# EasyEDA Pro project ProPrj_基于STM32的多功能串口分析仪_2025-03-12.epro, board PCB1
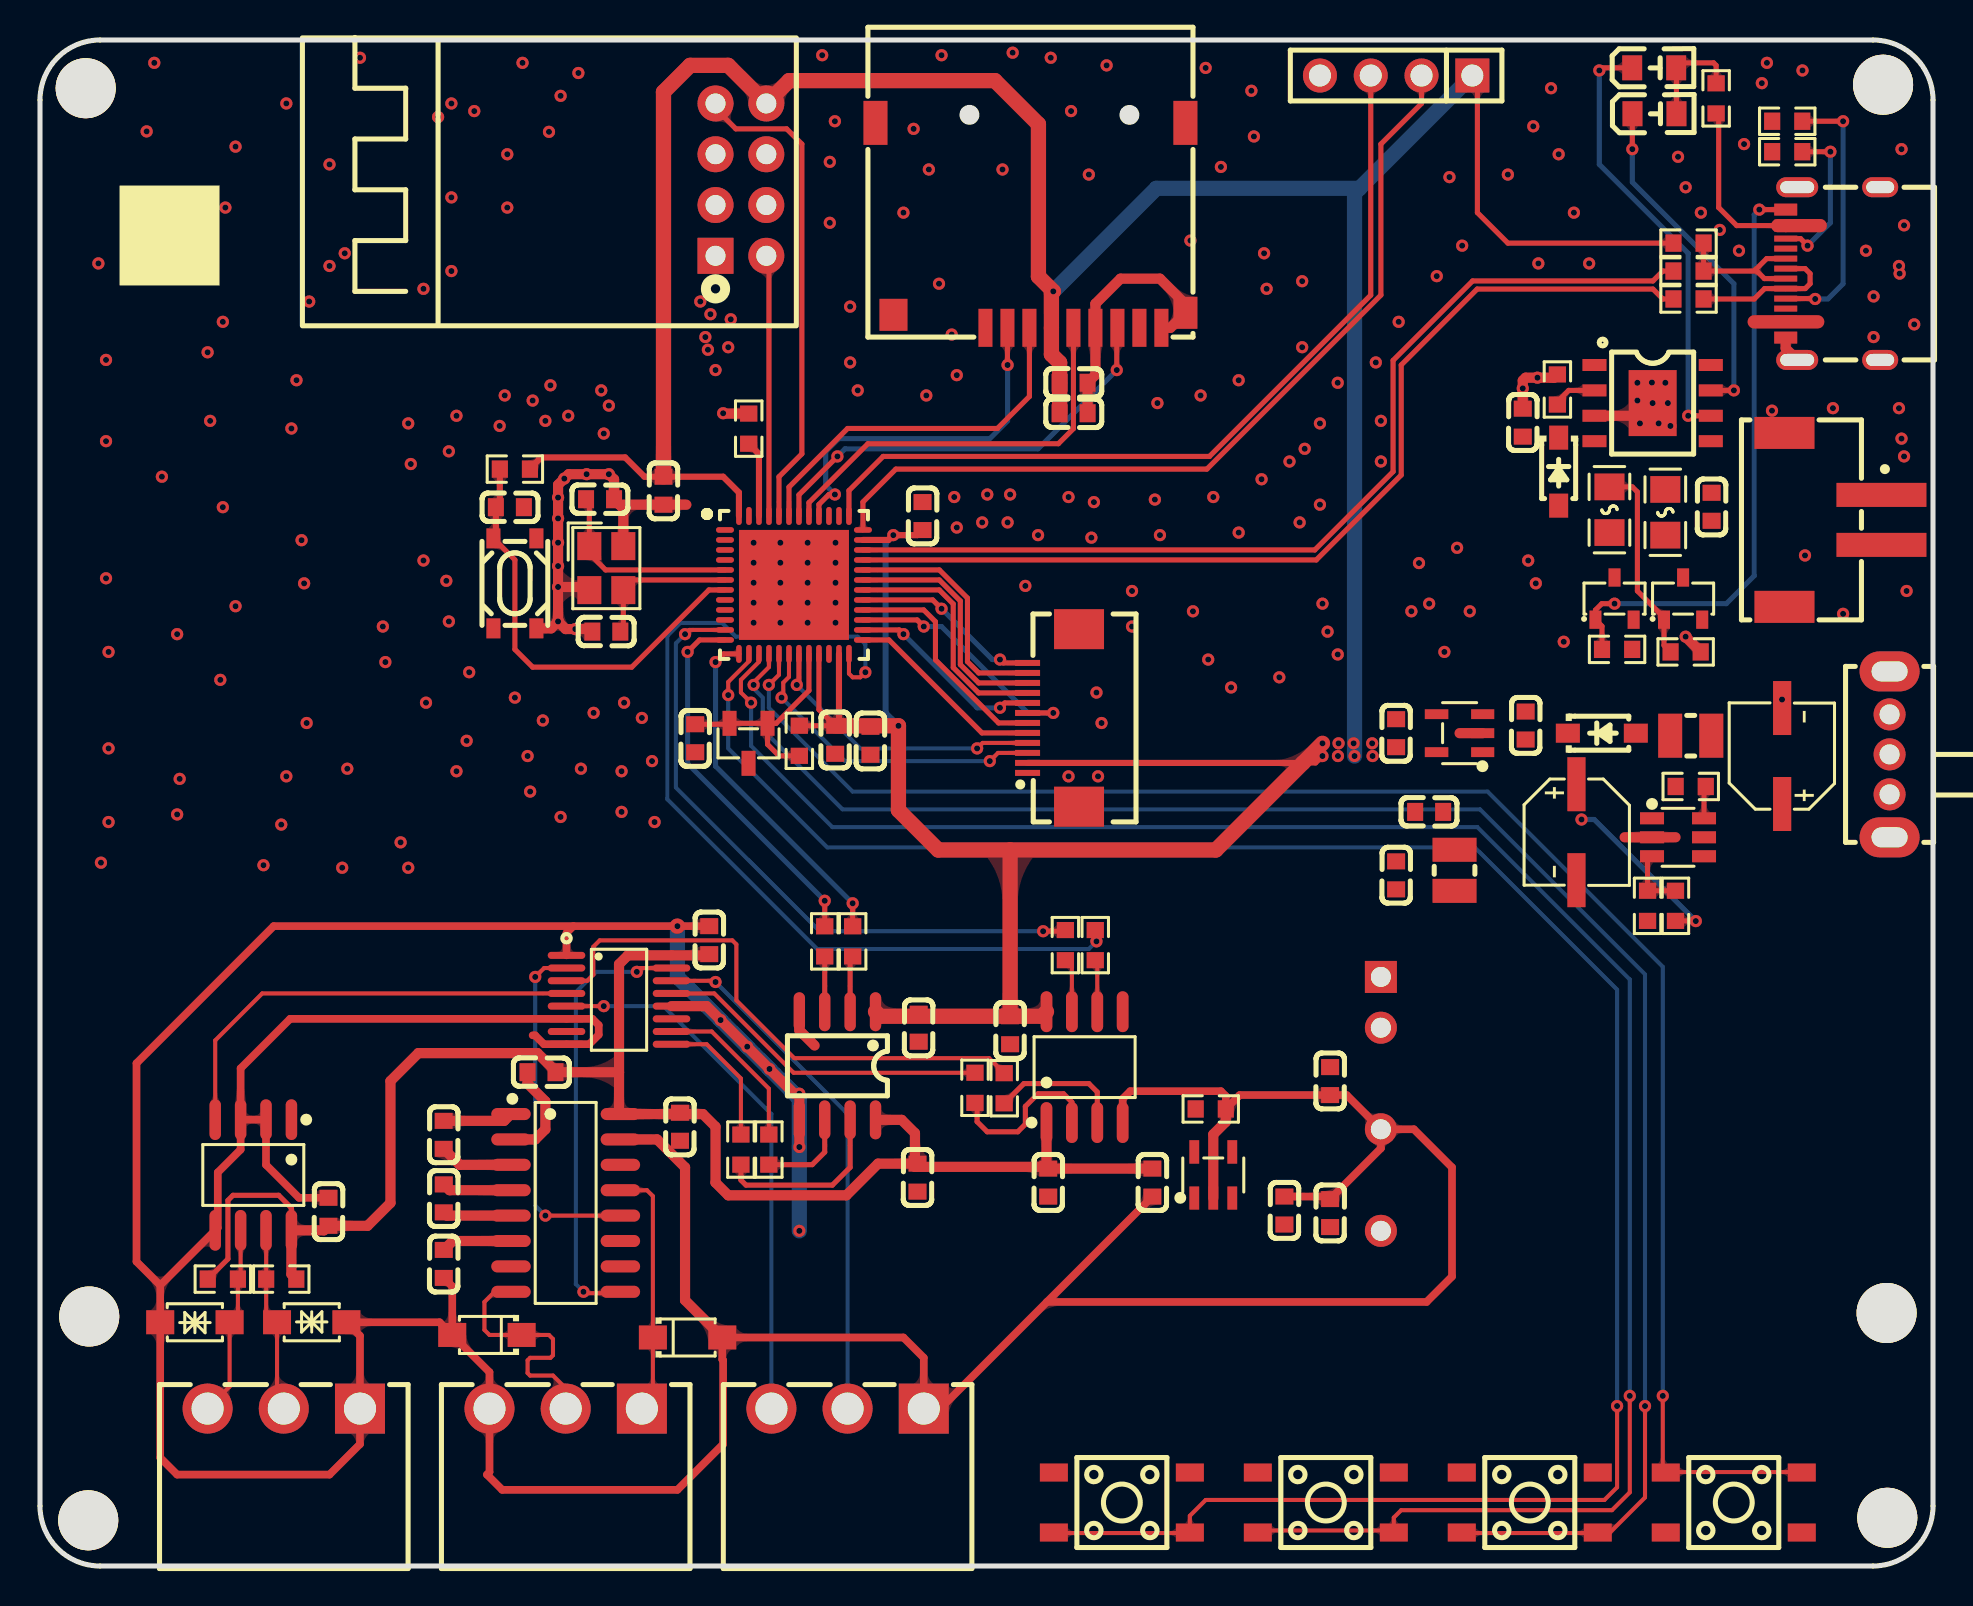
[diagram p17: board, top side]
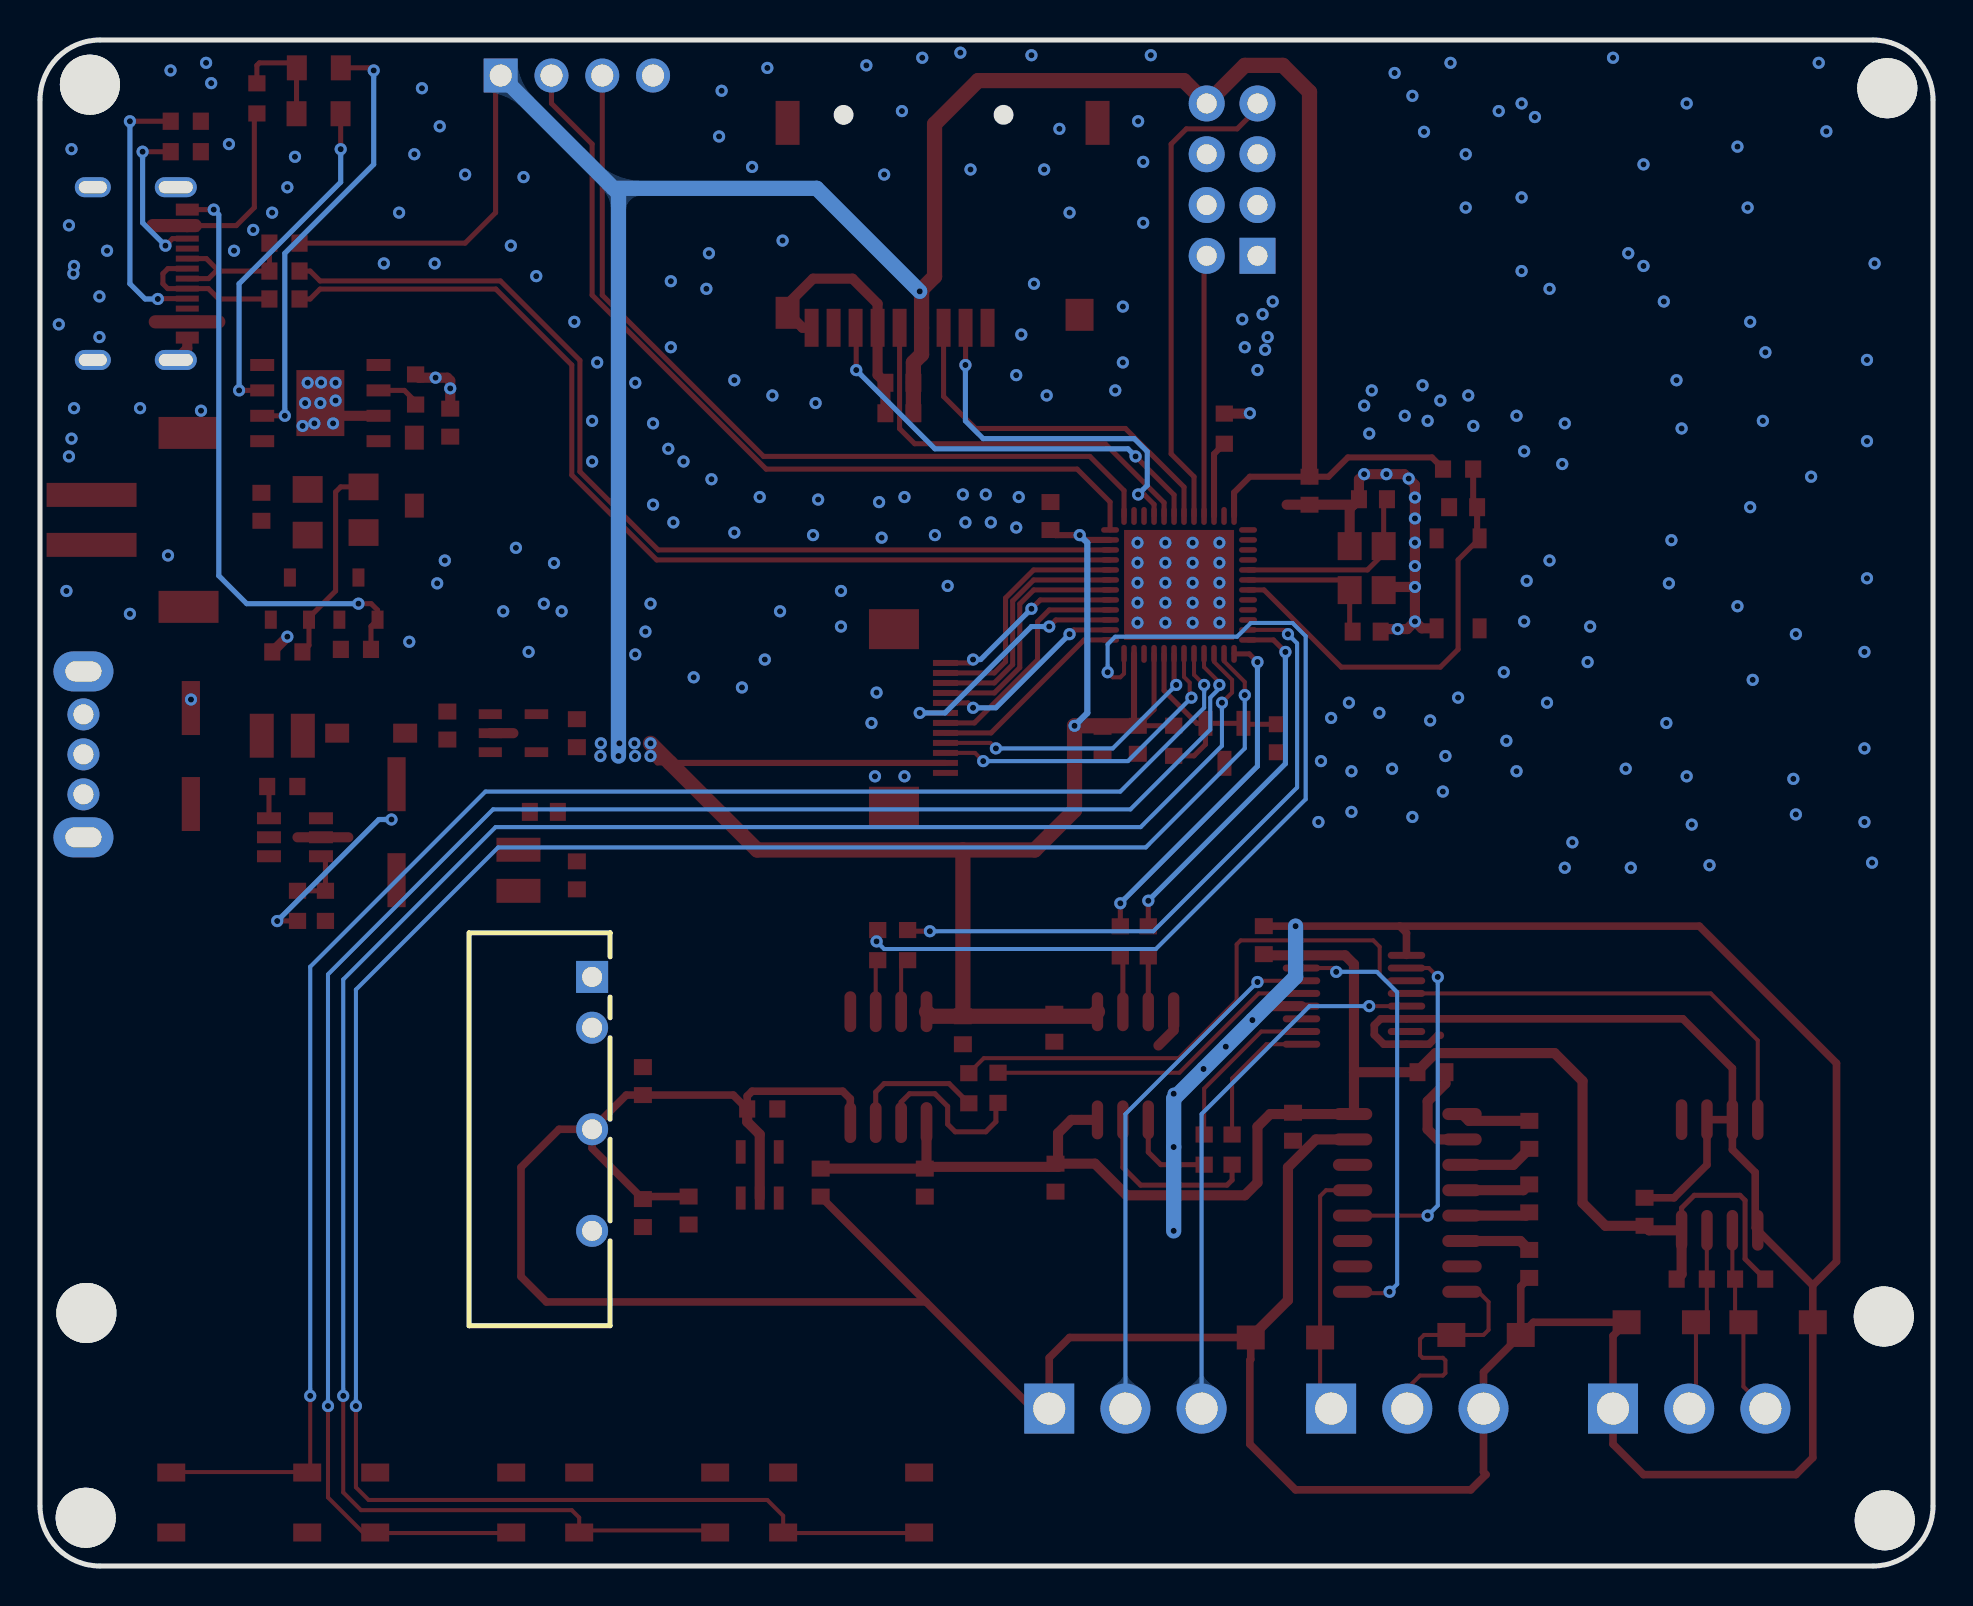
[diagram p18: board, bottom side, seen from below]

Outline 94.67 x 76.33 mm; copper layers: Top Layer, Bottom Layer. Coordinates in mm from the lower left corner of the outline.
Outline path: 0,73.33 0,3 arc(0.88,0.88) 3,0 91.67,0 arc(93.79,0.88) 94.67,3 94.67,73.33 arc(93.79,75.45) 91.67,76.33 3,76.33 arc(0.88,75.45) 0,73.33
Stack: Top Layer 0.035mm / Dielectric1 1.51mm FR4 er 4.5 / Bottom Layer 0.035mm

## Design rules (mm)
net USB_D+: DP1
net USB_D-: DP1
net PA11: DP2
net PA12: DP2
template: 自定义配置
spacing copperThickness1oz (default): track to track 0.102, other pairs 0.152 to 0.3
spacing copperThickness2oz: track to track 0.203, other pairs 0.152 to 0.3
track width copperThickness1oz (default): min 0.127, default 0.254, max 2.54
track width copperThickness2oz: min 0.203, default 0.254, max 2.54
differential pair differentialPair (default): width min 0.127, default 0.254, max 2.54; gap min 0.152, default 0.152
via viaSize (default): diameter min 0.5, default 0.61, max 10; hole min 0.3, default 0.305, max 6.3
net VBUS uses PWR
net $1N5372 uses PWR
net D_5V uses PWR
net 5V uses PWR
net DVDD uses PWR
net 3.3V uses PWR
net $1N8863 uses PWR
net BAT+ uses PWR
net $1N28343 uses PWR
net $1N9169 uses PWR
net VIN uses PWR
net $1N20026 uses PWR
net $1N19970 uses PWR

## Placement (name value [footprint] x y rotation side)
C1  1nF  [C0603]  64.52 24.25 270 top
C2  22uF  [C_Ele_SMD_5x5.4mm]  76.84 36.7 270 top
C3  4.7uF  [C0603]  69.47 37.72 0 top
C4  4.7uF  [C0603]  67.82 34.54 270 top
C5  10uF  [C0603]  62.23 17.78 270 top
C6  1uF  [C0603]  64.52 17.65 270 top
C7  10uF  [C0603]  74.15 57.19 270 top
C8  10uF  [C0603]  83.59 52.98 90 top
C9  1uF  [C0603]  55.63 19.18 270 top
C10  22uF  [C_Ele_SMD_5x5.4mm]  87.12 40.51 90 top
C11  100nF  [C0603]  48.51 26.8 90 top
C12  100nF  [C0603]  50.42 19.18 270 top
C13  100nF  [C0603]  25.08 24.7 0 top
C14  100nF  [C0603]  32 21.97 90 top
C15  100nF  [C0603]  31.18 53.78 90 top
C16  100nF  [C0603]  20.19 18.39 90 top
C17  100nF  [C0603]  20.19 21.57 270 top
C18  100nF  [C0603]  20.19 15.11 90 top
C19  100nF  [C0603]  41.53 41.28 90 top
C20  100nF  [C0603]  44.13 52.52 270 top
C21  100nF  [C0603]  23.5 52.96 180 top
C22  100nF  [C0603]  39.77 41.32 90 top
C23  100nF  [C0603]  43.94 26.92 90 top
C24  100nF  [C0603]  43.88 19.43 270 top
C25  100nF  [C0603]  14.42 17.72 270 top
C26  226  [C0603]  32.77 41.4 90 top
C27  12pF  [C0603]  28.32 46.74 0 top
C28  1uF  [C0603]  74.29 42.04 270 top
C29  1uF  [C0603]  67.82 41.66 90 top
C30  12pF  [C0603]  28.01 53.36 0 top
C31  100nF  [C0603]  33.47 31.3 270 top
C32  100nF  [C0603]  51.69 59.18 180 top
C33  10uF  [C0603]  51.69 57.66 180 top
CN1  DB2ERC-3.81-3P-GN  [CONN-TH_3P-P3.81_DB2ERC-3.81-3P]  26.29 7.87 0 top
CN2  DB2ERC-3.81-3P-GN  [CONN-TH_3P-P3.81_DB2ERC-3.81-3P]  12.19 7.87 0 top
CN3  DB2ERC-3.81-3P-GN  [CONN-TH_3P-P3.81_DB2ERC-3.81-3P]  40.39 7.87 0 top
D1  1N5819W  [SOD-123_L2.7-W1.6-LS3.7-RD-1]  78.1 41.66 0 top
D2  1N5819W  [SOD-123_L2.7-W1.6-LS3.7-RD-1]  75.95 54.74 270 top
D3  SMF15CA  [SOD-123FL_L2.7-W1.8-LS3.8-RD]  32.38 11.43 0 top
D4  SMF15CA  [SOD-123FL_L2.7-W1.8-LS3.8-RD]  22.35 11.56 180 top
D5  SMF6.5CA  [SOD-123FL_L2.7-W1.8-LS3.8-BI]  13.59 12.19 180 top
D6  SMF6.5CA  [SOD-123FL_L2.7-W1.8-LS3.8-BI]  7.75 12.19 0 top
F1  BSMD0805-010-33V  [F0805]  78.49 52.83 270 top
F2  BSMD0805-010-33V  [F0805]  81.28 52.71 270 top
FPC1  FPC-05F-12PH20  [FPC-SMD_12P-P0.50_FPC-05F-12PH20]  50.67 42.42 90 top
H1  -  [HDR-TH_4P-P2.54-V-F]  67.82 74.55 180 top
L2  6.8uH  [IND-SMD_L2.5-W2.0_FHD252010S-6R8MT]  70.74 34.8 90 top
L3  6.8uH  [IND-SMD_L2.5-W2.0_FHD252010S-6R8MT]  82.55 41.53 0 top
LED1  -  [LED_0805]  80.79 72.63 0 top
LED2  -  [LED_0805]  80.77 74.93 0 top
NOREF  -  [Pad_e108]  2.46 12.48 270 top
NOREF#2  -  [Pad_e48206]  92.38 2.41 0 top
NOREF#3  -  [Pad_e48205]  2.41 2.29 270 top
NOREF#4  -  [Pad_e107]  2.29 73.91 180 top
NOREF#5  -  [Pad_e110]  92.17 74.09 90 top
NOREF#6  -  [Pad_e109]  92.35 12.66 0 top
Q1  AO3401  [SOT-23-3_L2.9-W1.4-P1.90-LS2.6-BR]  78.74 48.39 270 top
Q2  AO3401  [SOT-23-3_L2.9-W1.4-P1.90-LS2.6-BR]  82.17 48.39 270 top
R1  1K  [R0603]  75.88 58.85 90 top
R2  1K  [R0603]  83.82 73.41 270 top
R3  20K  [R0603]  81.79 33.02 270 top
R4  93.1K  [R0603]  82.55 38.99 0 top
R5  510  [R0603]  58.55 22.86 180 top
R6  2.7K  [R0603]  80.39 33.02 90 top
R7  10K  [R0603]  78.87 45.85 180 top
R8  22R  [R0603]  51.28 31.06 270 top
R9  22R  [R0603]  46.76 23.92 90 top
R10  10K  [R0603]  23.75 54.86 0 top
R11  22R  [R0603]  52.77 31.06 270 top
R12  22R  [R0603]  48.22 23.9 90 top
R13  10K  [R0603]  82.3 45.72 0 top
R14  22R  [R0603]  40.64 31.24 270 top
R15  22R  [R0603]  35.05 20.83 90 top
R16  100R  [R0603]  37.97 41.28 90 top
R17  5.1K  [R0603]  87.38 72.26 180 top
R18  5.1K  [R0603]  87.38 70.74 180 top
R19  22R  [R0603]  39.24 31.24 270 top
R20  22R  [R0603]  36.45 20.83 90 top
R21  10K  [R0603]  12.06 14.35 0 top
R23  10K  [R0603]  35.44 56.89 90 top
R24  22R  [R0603]  82.44 64.77 180 top
R25  22R  [R0603]  82.44 63.37 180 top
R27  10K  [R0603]  9.14 14.35 0 top
R29  5.1K  [R0603]  82.44 66.17 0 top
SW1  SK12D07VG5  [SW-TH_SK12D07VG5]  92.49 40.6 90 top
SW2  TS3425BA  [SW-SMD_4P-L4.2-W3.2-P2.15-LS4.6-1]  23.75 49.15 270 top
SW3  TS4570TP  [SW-SMD_4P-L4.5-W4.5-P3.00-LS7.0]  84.7 3.18 0 top
SW4  TS4570TP  [SW-SMD_4P-L4.5-W4.5-P3.00-LS7.0]  74.5 3.18 180 top
SW5  TS4570TP  [SW-SMD_4P-L4.5-W4.5-P3.00-LS7.0]  64.3 3.18 180 top
SW6  TS4570TP  [SW-SMD_4P-L4.5-W4.5-P3.00-LS7.0]  54.1 3.18 180 top
U1  B0505S-3WR2  [PWRM-TH_B0505S-3WR2]  67.06 23.11 270 bottom
U2  TP4056  [ESOP-8_L4.9-W3.9-P1.27-LS6.0-BL-EP]  80.65 58.17 270 top
U3  RT9013-33GB  [SOT-23-5_L3.0-W1.7-P0.95-LS2.8-BL]  58.67 19.56 0 top
U4  MT3608L  [SOT-23-6_L2.9-W1.6-P0.95-LS2.8-BL_3]  81.91 36.45 270 top
U5  STM32G431CBU6  [UFQFPN-48_L7.0-W7.0-P0.50-BL-EP]  37.7 49.07 270 top
U6  ZX-XH2.54-2PLT  [CONN-SMD_2P-P2.50_HCTL_HC-XH-2ALT]  89.66 52.32 270 top
U7  MAX3232ESE+T  [SOIC-16_L9.9-W3.9-P1.27-LS6.0-BL]  26.29 18.16 270 top
U8  π120M31  [SOIC-8_L4.9-W3.9-P1.27-LS6.0-BL]  52.24 24.95 0 top
U9  π120U31  [soic-8_l5.0-w4.0-p1.27-ls6.0-bl]  39.88 25.02 180 top
U10  MAX3485ESA  [SOP-8_L5.0-W4.0-P1.27-LS6.0-BL]  10.67 19.56 180 top
U11  TL431  [SOT-23-3_L2.9-W1.3-P1.90-LS2.4-BR]  35.43 41.15 90 top
U12  RT9013-33GB  [SOT-23-5_L3.0-W1.7-P0.95-LS2.8-BL]  70.99 41.66 90 top
U13  -  [JLC-QRCODE-5x5]  6.48 66.55 0 top
U14  MR01A-01239  [TF-SMD_MR01A-01211]  49.53 67.06 180 top
U15  RS2252XSS16  [SSOP-16_L4.9-W3.9-P0.635-LS6.0-BL]  28.96 28.32 270 top
U16  Ai-Thinker ESP-01S ESP8266  [WIFIM-TH_8P-L24.7-W14.4-P2.54]  35.05 69.34 180 top
USB1  TYPE-C 16P(073)  [USB-C-SMD_TYPE-C16PIN_C668624]  89.66 64.64 90 top
X1  8MHz  [CRYSTAL-SMD_4P-L3.2-W2.5-BL]  28.32 49.91 270 top

## Footprints (pads in the part's own frame, mm; a bottom-side part is the same pattern mirrored in y, then rotated)
C0603
  rect 0.8x0.9 smd: 1(-0.7,0) 2(0.7,0)
C_Ele_SMD_5x5.4mm
  rect 2.7x0.91 smd: 1(-2.4,0) 2(2.4,0)
CONN-SMD_2P-P2.50_HCTL_HC-XH-2ALT
  rect 1.2x4.5 smd: 1(-1.25,2.425) 2(1.25,2.425)
  rect 1.6x3 smd: 3(4.35,-2.425) 4(-4.35,-2.425)
CONN-TH_3P-P3.81_DB2ERC-3.81-3P
  rect 2.5x2.5 hole 1.6: 1(3.81,0)
  round 2.5 hole 1.6: 2(0,0) 3(-3.81,0)
CRYSTAL-SMD_4P-L3.2-W2.5-BL
  rect 1.4x1.2 smd: 1(-1.1,-0.85) 2(1.1,-0.85) 3(1.1,0.85) 4(-1.1,0.85)
ESOP-8_L4.9-W3.9-P1.27-LS6.0-BL-EP
  rect 0.6x1.2 smd: 1(-1.905,-2.909) 2(-0.635,-2.909) 3(0.635,-2.909) 4(1.905,-2.909) 5(1.905,2.909) 6(0.635,2.909) 7(-0.635,2.909) 8(-1.905,2.909)
  rect 3.3x2.4 smd: 9(0,0)
F0805
  rect 1.335x1.5 smd: 1(-1.143,0) 2(1.143,0)
FPC-SMD_12P-P0.50_FPC-05F-12PH20
  rect 0.3x1.25 smd: 1(-2.75,1.288) 2(-2.25,1.288) 3(-1.75,1.288) 4(-1.25,1.288) 5(-0.75,1.288) 6(-0.25,1.288) 7(0.25,1.288) 8(0.75,1.288) 9(1.25,1.288) 10(1.75,1.288) 11(2.25,1.288) 12(2.75,1.288)
  rect 2x2.5 smd: 13(4.44,-1.288) 14(-4.44,-1.288)
HDR-TH_4P-P2.54-V-F
  rect 1.7x1.7 hole 1.1: 1(-3.81,0)
  round 1.7 hole 1.1: 2(-1.27,0) 3(1.27,0) 4(3.81,0)
IND-SMD_L2.5-W2.0_FHD252010S-6R8MT
  rect 1.2x2.2 smd: 1(1.028,0) 2(-1.028,0)
LED_0805
  rect 1x1.25 smd: 1(-1.15,0.005) 2(1.05,0.005)
Pad_e107
  round 3 hole 3: 43(0,0)
Pad_e108
  round 3 hole 3: 43(0,0)
Pad_e109
  round 3 hole 3: 43(0,0)
Pad_e110
  round 3 hole 3: 43(0,0)
Pad_e48205
  round 3 hole 3: 43(0,0)
Pad_e48206
  round 3 hole 3: 43(0,0)
PWRM-TH_B0505S-3WR2
  rect 1.6x1.6 hole 1: 1(-6.35,0)
  round 1.6 hole 1: 2(-3.81,0) 4(1.27,0) 6(6.35,0)
R0603
  rect 0.806x0.864 smd: 1(-0.753,0) 2(0.753,0)
SOD-123_L2.7-W1.6-LS3.7-RD-1
  rect 1.2x0.95 smd: 1(-1.7,0) 2(1.7,0)
SOD-123FL_L2.7-W1.8-LS3.8-BI
  rect 1.4x1.2 smd: 1(-1.735,0) 2(1.735,0)
SOD-123FL_L2.7-W1.8-LS3.8-RD
  rect 1.4x1.2 smd: 1(-1.735,0) 2(1.735,0)
SOIC-8_L4.9-W3.9-P1.27-LS6.0-BL
  oval 0.588x2.045 smd: 1(-1.905,-2.772) 2(-0.635,-2.772) 3(0.635,-2.772) 4(1.905,-2.772) 5(1.905,2.772) 6(0.635,2.772) 7(-0.635,2.772) 8(-1.905,2.772)
soic-8_l5.0-w4.0-p1.27-ls6.0-bl
  oval 0.569x1.95 smd: 1(-1.905,-2.705) 2(-0.635,-2.705) 3(0.635,-2.705) 4(1.905,-2.705) 5(1.905,2.705) 6(0.635,2.705) 7(-0.635,2.705) 8(-1.905,2.705)
SOIC-16_L9.9-W3.9-P1.27-LS6.0-BL
  oval 0.602x1.971 smd: 1(-4.445,-2.736) 2(-3.175,-2.736) 3(-1.905,-2.736) 4(-0.635,-2.736) 5(0.635,-2.736) 6(1.905,-2.736) 7(3.175,-2.736) 8(4.445,-2.736) 9(4.445,2.736) 10(3.175,2.736) 11(1.905,2.736) 12(0.635,2.736) 13(-0.635,2.736) 14(-1.905,2.736) 15(-3.175,2.736) 16(-4.445,2.736)
SOP-8_L5.0-W4.0-P1.27-LS6.0-BL
  oval 0.574x2.035 smd: 1(-1.905,-2.768) 2(-0.635,-2.768) 3(0.635,-2.768) 4(1.905,-2.768) 5(1.905,2.768) 6(0.635,2.768) 7(-0.635,2.768) 8(-1.905,2.768)
SOT-23-3_L2.9-W1.3-P1.90-LS2.4-BR
  rect 1.25x0.7 smd: 1(1,-0.95) 2(1,0.95) 3(-1,0)
SOT-23-3_L2.9-W1.4-P1.90-LS2.6-BR
  rect 0.91x0.6 smd: 1(1.055,-0.955) 2(1.055,0.955) 3(-1.055,0)
SOT-23-5_L3.0-W1.7-P0.95-LS2.8-BL
  rect 0.49x1.157 smd: 1(-0.95,-1.153) 2(0,-1.153) 3(0.95,-1.153)
  rect 0.49x1.175 smd: 4(0.95,1.153) 5(-0.95,1.153)
SOT-23-6_L2.9-W1.6-P0.95-LS2.8-BL_3
  rect 0.6x1.2 smd: 1(-0.95,-1.3) 2(0,-1.3) 3(0.95,-1.3) 4(0.95,1.3) 5(0,1.3) 6(-0.95,1.3)
SSOP-16_L4.9-W3.9-P0.635-LS6.0-BL
  oval 0.35x1.876 smd: 1(-2.223,-2.626) 2(-1.587,-2.626) 3(-0.953,-2.626) 4(-0.318,-2.626) 5(0.318,-2.626) 6(0.953,-2.626) 7(1.587,-2.626) 8(2.223,-2.626) 9(2.223,2.626) 10(1.587,2.626) 11(0.953,2.626) 12(0.318,2.626) 13(-0.318,2.626) 14(-0.953,2.626) 15(-1.587,2.626) 16(-2.223,2.626)
SW-SMD_4P-L4.2-W3.2-P2.15-LS4.6-1
  rect 1x0.7 smd: 1(-2.25,1.075) 2(2.25,1.075) 3(-2.25,-1.075) 4(2.25,-1.075)
SW-SMD_4P-L4.5-W4.5-P3.00-LS7.0
  rect 1.4x0.9 smd: 1(-3.4,1.5) 2(3.4,1.5) 3(-3.4,-1.5) 4(3.4,-1.5)
SW-TH_SK12D07VG5
  oval 1.6x1.6 hole 1: 1(-2,0) 2(0,0) 3(2,0)
  oval 2x3 hole 1x1.8: 4(4.15,0) 5(-4.15,0)
TF-SMD_MR01A-01211
  rect 0.7x1.9 smd: 1(2.25,5.125) 2(1.15,5.125) 3(0.05,5.125) 4(-1.05,5.125) 5(-2.15,5.125) 6(-3.25,5.125) 7(-4.35,5.125) 8(-5.45,5.125) 9(-6.55,5.125)
  rect 1.2x1.6 smd: 10(-7.75,4.375)
  rect 1.2x2.2 smd: 11(-7.75,-5.125) 12(7.75,-5.125)
  rect 1.4x1.6 smd: 13(6.85,4.475)
UFQFPN-48_L7.0-W7.0-P0.50-BL-EP
  oval 0.28x0.9 smd: 1(-2.751,-3.45) 2(-2.251,-3.45) 3(-1.75,-3.45) 4(-1.25,-3.45) 5(-0.749,-3.45) 6(-0.249,-3.45) 7(0.249,-3.45) 8(0.75,-3.45) 9(1.25,-3.45) 10(1.75,-3.45) 11(2.251,-3.45) 12(2.751,-3.45) 25(2.751,3.449) 26(2.251,3.449) 27(1.75,3.449) 28(1.25,3.449) 29(0.75,3.449) 30(0.249,3.449) 31(-0.249,3.449) 32(-0.749,3.449) 33(-1.25,3.449) 34(-1.75,3.449) 35(-2.251,3.449) 36(-2.751,3.449)
  oval 0.9x0.28 smd: 13(3.45,-2.751) 14(3.45,-2.251) 15(3.45,-1.75) 16(3.45,-1.25) 17(3.45,-0.75) 18(3.45,-0.249) 19(3.45,0.249) 20(3.45,0.749) 21(3.45,1.25) 22(3.45,1.75) 23(3.45,2.251) 24(3.45,2.751) 37(-3.449,2.751) 38(-3.449,2.251) 39(-3.449,1.75) 40(-3.449,1.25) 41(-3.449,0.749) 42(-3.449,0.249) 43(-3.449,-0.249) 44(-3.449,-0.75) 45(-3.449,-1.25) 46(-3.449,-1.75) 47(-3.449,-2.251) 48(-3.449,-2.751)
  rect 5.5x5.5 smd: 49(0,0)
USB-C-SMD_TYPE-C16PIN_C668624
  oval 1x2.1 hole 0.6x1.7: 1(-4.32,1.788) 2(4.32,1.788)
  oval 1x1.8 hole 0.6x1.4: 3(-4.32,-2.362) 4(4.32,-2.362)
  rect 0.6x1.15 smd: A1B12(-3.2,2.362) A4B9(-2.4,2.362) B1A12(3.2,2.362) B4A9(2.4,2.362)
  rect 0.3x1.15 smd: A5(-1.25,2.362) A6(-0.25,2.362) A7(0.25,2.362) A8(1.25,2.362) B5(1.75,2.362) B6(0.75,2.362) B7(-0.75,2.362) B8(-1.75,2.362)
WIFIM-TH_8P-L24.7-W14.4-P2.54
  rect 1.8x1.8 hole 1: 1(1.27,3.81)
  round 1.8 hole 1: 2(1.27,1.27) 3(1.27,-1.27) 4(1.27,-3.81) 5(-1.27,3.81) 6(-1.27,1.27) 7(-1.27,-1.27) 8(-1.27,-3.81)

## Nets
As in the schematic, except:
3.3V: C11.2 C15.2 C19.2 C20.2 C22.2 C23.2 C29.1 C32.2 C33.2 FPC1.2 H1.1 R10.2 R16.2 R29.1 U5.21 U5.23 U5.35 U5.48 U8.8 U9.1 U12.5 U14.4 U16.8
PGND: C1.1 C2.2 C3.1 C4.1 C7.1 C8.1 C10.2 C11.1 C15.1 C19.1 C20.1 C21.1 C22.1 C23.1 C26.1 C27.1 C28.1 C29.2 C30.2 C32.1 C33.1 FPC1.1 FPC1.13 FPC1.14 H1.4 NOREF#2.43 R1.2 R4.1 R6.1 R13.2 R17.2 R18.2 R23.2 SW2.2 SW3.3 SW3.4 SW4.3 SW4.4 SW5.3 SW5.4 SW6.3 SW6.4 U1.2 U2.3 U2.9 U4.2 U5.49 U6.2 U6.3 U6.4 U8.5 U9.4 U11.3 U12.2 U14.6 U14.9 U14.10 U14.11 U14.12 U14.13 U16.1 USB1.1 USB1.2 USB1.3 USB1.4 USB1.A1B12 X1.2 X1.4
USB_D+: R24.1 R29.2 USB1.A6 USB1.B6

Pads without a net: NOREF 43; NOREF#3 43; NOREF#4 43; NOREF#5 43; NOREF#6 43; SW1 3 4 5; SW2 1 4; U2 1; U3 4; U5 1; U7 7 10 11 14; U10 1; U12 4; U14 1 8; U15 7; U16 2 3 6 7; USB1 A8 B8

## Via types
v1: diameter 0.61, hole 0.305, Top Layer to Bottom Layer, 320 vias

## Routing (per net, layer and track width the routed paths; a pad name or vN(x,y) marks a point on that pad's centre or on a via; arc(x,y) is an arc through that point)
3.3V: length 225.7
  Top Layer w0.254: R29.1 73.41,66.17 71.88,67.69 71.88,74.3 H1.1 ; U5.21 38.95,42.84 39.76,42.03 ; 39.76,42.03 R16.2 ; 39.76,42.03 C22.2 ; v1(64.13,40.51) 63.79,40.17 63.16,40.17
  Top Layer w0.305: 63.16,40.17 FPC1.2 ; R10.2 24.5,54.89 25.06,55.45 29.26,55.45 30.23,54.48 C15.2 34.16,54.48 34.95,53.69 U5.48 ; 41.15,51.32 42.43,51.32 v1(42.67,51.56) 43.88,51.56 C20.2 ; C22.2 39.95,42.21 U5.23
  Top Layer w0.762: v1(64.13,41.15) 58.8,35.81 48.51,35.81 ; C11.2 42.01,27.5 U9.1 ; C11.2 48.51,35.81 ; C11.2 50.1,27.5 50.33,27.73 ; C15.2 31.18,73.73 32.51,75.06 34.42,75.06 U16.8 37.47,74.3 47.75,74.3 49.93,72.12 49.93,64.5 v1(50.67,63.75) 50.58,63.66 U14.4 50.58,60.6 50.99,60.19 C32.2 C33.2 ; C22.2 v1(42.93,42.02) 42.93,37.8 44.92,35.81 48.51,35.81
  Bottom Layer w0.305: v1(42.67,51.56) 42.29,51.18 42.29,42.66 v1(42.93,42.02)
  Bottom Layer w0.762: v1(50.67,63.75) 55.83,68.91 65.99,68.91 ; 65.99,68.91 65.74,68.66 v1(65.74,40.51) ; 65.99,68.91 H1.1
  vias: v1(64.91,40.51) v1(64.94,41.15) v1(65.69,41.15) v1(66.62,41.15) v1(66.64,40.51)
5V: length 8.8
  Top Layer w0.254: v1(82.8,32.26) 82.8,32.27 R3.2
  Bottom Layer w0.254: v1(77.09,37.34) 77.72,37.34 v1(82.8,32.26)
DGND: length 277.3
  Top Layer w0.381: U15.1 26.33,31.66 26.67,32 ; U8.4 54.14,23.37 54.52,23.75 59.06,23.75 59.3,23.5 R5.1 59.99,23.55 C1.2 65.35,23.55 U1.4 ; C5.1 64.39,18.48 C6.1 67.06,20.89 U1.4 ; U10.3 U10.2 11.3,20.07 12.95,18.42 C25.1 ; U10.3 10.03,20.83 8.89,19.69 8.89,16.92 U10.5 6.01,14.04 ; U10.3 10.03,24.89 12.51,27.37 U15.6 27.62,27.37 27.94,27.05 27.94,26.57 27.47,26.1 U15.8 25.2,26.1 24.76,26.54 24.64,26.54 ; C18.1 20.62,13.99 D4.2 ; 6.01,14.04 4.83,15.22 4.83,25.15 11.68,32 26.67,32 ; 6.01,14.04 D6.1 6.01,5.42 6.86,4.57 14.48,4.57 16,6.1 CN2.1 16,11.51 D5.1 19.98,12.19 D4.2 ; 50.36,13.21 C9.2 ; 50.36,13.21 45.02,7.87 CN3.1 44.2,10.41 43.18,11.43 D3.2 34.12,10.33 34.16,10.29 34.16,6.1 31.88,3.81 23.11,3.81 22.35,4.57 22.48,4.7 CN1.3 22.48,9.69 D4.2 ; 50.36,13.21 69.34,13.21 70.61,14.48 70.61,19.94 68.71,21.84 U1.4 ; 26.67,32 31.87,32 ; v1(31.88,32) C31.1
  Top Layer w0.508: U7.15 30.86,21.34 32.26,19.94 32.26,13.29 D3.2 ; v1(37.97,20.96) U9.5 v1(37.97,23.62) 37.72,23.62 v1(36.48,24.86) v1(35.37,25.98) v1(34.04,27.31) 33.34,28 U15.12 ; U3.2 58.67,21.59 59.3,22.22 R5.1
  Top Layer w0.762: v1(31.88,32) 31.87,32
  Bottom Layer w0.762: v1(31.88,32) 31.88,29.46 v1(34.04,27.31) v1(35.37,25.98) v1(36.48,24.86) 37.97,23.37 v1(37.97,20.96) v1(37.97,16.76)
DVDD: length 84.9
  Top Layer w0.254: R27.1 9.4,15.36 9.4,18.29 9.65,18.54 11.94,18.54 12.57,17.91 U10.8
  Top Layer w0.508: C12.1 C9.1 ; C12.1 50.33,19.88 50.33,19.96 ; C12.1 50.33,19.96 ; C31.2 33.41,30.54 U15.16 29.4,30.54 28.96,30.1 28.96,24.7 ; 50.33,19.96 43.76,19.96 43.76,20.12 ; 50.33,19.96 U8.1 ; 43.76,20.12 43.76,21.65 43.09,22.31 U9.8 ; 43.76,20.12 C24.1 ; 43.76,20.12 41.91,20.12 40.33,18.54 34.42,18.54 33.78,19.18 33.78,21.97 33.15,22.61 U7.16 28.96,22.67 28.96,24.7 ; 28.96,24.7 C13.2 25.78,24.75 24.88,25.65 18.92,25.65 17.53,24.26 17.53,18.16 16.38,17.02 14.42,17.02 14.2,16.79 U10.8 12.57,14.6 R21.2
PGND: length 50.6
  Top Layer w0.508: v1(25.91,48.97) v1(25.91,50.01) v1(25.91,51.18) v1(25.91,52.4) v1(25.91,53.44) 25.91,54.08 v1(26.22,54.39) 26.44,54.61 v1(27.33,54.61) v1(28.45,54.61) 28.71,54.35 28.71,53.36 28.98,53.08 ; v1(25.91,48.97) 27.31,48.97 X1.2 ; v1(25.91,48.97) v1(25.91,47.24) ; R13.2 82.3,46.47 v1(82.3,46.48) ; R1.2 75.72,59.44 v1(74.88,59.44) 74.29,59.44 74.15,59.29 v1(74.15,58.9) 74.15,57.89 ; v1(34.16,57.66) 34.18,57.64 35.44,57.64 ; U2.3 80.01,57.53 v1(80.65,58.17) ; USB1.1 87.3,60.9 USB1.A1B12 ; 79.25,36.45 U4.2 81.79,36.45 ; 28.98,53.08 C15.1 32.32,53.08 ; 28.98,53.08 29.17,52.89 X1.4 ; C33.1 C32.1 52.78,59.57 U14.6 52.78,63.14 54.03,64.39 56.01,64.39 57.28,63.12 U14.10 56.53,61.93 U14.9 ; v1(25.91,47.24) 25.56,46.9 24.82,46.9 ; v1(25.91,47.24) 26.29,46.86 v1(26.77,46.86) 27.49,46.86 C27.1 ; 38.73,26.04 37.97,26.8 U9.4 ; U12.2 70.99,41.66
  vias: v1(2.92,65.15) v1(3.05,35.18) v1(3.3,60.33) v1(3.3,56.26) v1(3.3,49.4) v1(3.43,45.72) v1(3.43,40.89) v1(3.43,37.21) v1(5.33,71.76) v1(5.72,75.18) v1(6.1,54.48) v1(6.86,46.61) v1(6.86,37.59) v1(6.98,39.37) v1(8.38,60.71) v1(8.51,57.28) v1(9.02,44.32) v1(9.14,62.23) v1(9.14,52.96) v1(9.27,67.95) v1(9.78,70.99) v1(9.78,48.01) v1(11.18,35.05) v1(12.06,37.08) v1(12.32,73.15) v1(12.32,39.5) v1(12.57,56.9) v1(12.83,59.31) v1(13.08,51.31) v1(13.21,49.15) v1(13.33,42.16) v1(13.46,63.25) v1(14.48,70.1) v1(14.48,65.02) v1(15.11,34.93) v1(15.24,65.66) v1(15.37,39.88) v1(16,75.44) v1(17.14,46.99) v1(17.27,45.21) v1(18.03,36.2) v1(18.41,57.15) v1(18.41,34.93) v1(18.54,55.12) v1(19.18,63.88) v1(19.18,50.29) v1(19.3,43.18) v1(19.91,72.47) v1(20.32,49.28) v1(20.45,55.75) v1(20.45,47.24) v1(20.57,73.15) v1(20.57,68.45) v1(20.57,64.77) v1(20.83,57.53) v1(20.83,39.75) v1(21.34,41.28) v1(21.46,44.7) v1(21.72,72.77) v1(22.99,57.02) v1(23.24,58.55) v1(23.37,70.61) v1(23.37,67.95) v1(23.75,43.43) v1(24.13,75.18) v1(24.38,40.51) v1(24.51,38.73) v1(24.64,58.29) v1(25.15,42.29) v1(25.27,57.28) v1(25.45,71.73) v1(25.53,59.06) v1(26.03,73.53) v1(26.03,37.47) v1(26.42,57.53) v1(26.92,74.68) v1(27.05,39.88) v1(27.69,42.67) v1(28.07,58.8) v1(28.19,56.64) v1(28.45,58.04) v1(29.08,39.75) v1(29.08,37.72) v1(29.21,43.18) v1(30.1,42.42) v1(30.61,40.26) v1(30.73,37.21) v1(33.02,63.25) v1(33.27,61.47) v1(33.4,60.83) v1(33.53,62.61) v1(33.78,59.82) v1(34.42,60.96) v1(34.54,62.36) v1(35.69,51.18) v1(35.69,50.18) v1(35.69,49.18) v1(35.69,48.18) v1(35.69,47.18) v1(37.02,51.18) v1(37.02,50.18) v1(37.02,49.18) v1(37.02,48.18) v1(37.02,47.18) v1(38.39,51.18) v1(38.39,50.18) v1(38.39,49.18) v1(38.39,48.18) v1(38.39,47.18) v1(39.12,75.57) v1(39.5,70.23) v1(39.5,67.18) v1(39.75,72.26) v1(39.78,51.18) v1(39.78,50.18) v1(39.78,49.18) v1(39.78,48.18) v1(39.78,47.18) v1(40.51,62.99) v1(40.51,60.2) v1(40.89,58.8) v1(43.18,67.69) v1(43.69,71.88) v1(44.32,58.55) v1(44.45,69.85) v1(44.96,64.14) v1(45.09,75.57) v1(45.59,61.6) v1(45.72,53.47) v1(45.85,59.56) v1(45.85,51.94) v1(47.12,52.2) v1(47.37,53.59) v1(48.13,69.85) v1(48.39,52.2) v1(48.51,53.59) v1(48.64,75.69) v1(49.28,49.02) v1(49.91,51.56) v1(50.55,75.44) v1(51.44,53.47) v1(51.44,39.5) v1(51.56,72.77) v1(52.45,69.6) v1(52.58,51.44) v1(52.7,53.21) v1(52.83,43.69) v1(52.91,39.5) v1(53.09,42.16) v1(53.34,75.06) v1(54.61,48.77) v1(54.61,46.99) v1(55.75,53.34) v1(55.88,58.17) v1(56.01,51.56) v1(57.53,66.29) v1(57.66,47.75) v1(58.04,58.55) v1(58.29,74.93) v1(58.42,45.34) v1(58.67,53.47) v1(59.06,69.98) v1(59.56,43.94) v1(59.94,59.31) v1(59.94,51.69) v1(60.58,73.79) v1(60.71,71.5) v1(61.09,54.36) v1(61.21,65.66) v1(61.34,63.88) v1(61.98,44.45) v1(62.48,55.25) v1(62.99,52.2) v1(63.12,64.26) v1(63.12,60.96) v1(63.25,55.88) v1(64.01,57.15) v1(64.01,53.09) v1(64.13,48.13) v1(64.39,46.74) v1(64.9,59.18) v1(64.9,45.59) v1(66.8,60.2) v1(67.06,57.28) v1(67.06,55.25) v1(67.94,62.23) v1(68.58,47.75) v1(68.96,50.17) v1(69.47,48.13) v1(69.85,64.52) v1(70.23,45.72) v1(70.48,69.47) v1(70.87,50.93) v1(71.12,66.04) v1(71.5,47.75) v1(73.41,69.6) v1(74.42,50.29) v1(74.68,72.01) v1(74.8,49.15) v1(74.93,65.15) v1(75.56,73.91) v1(75.95,70.61) v1(76.2,46.23) v1(76.71,67.69) v1(77.47,65.15) v1(79.88,59.18) v1(79.88,58.29) v1(80.01,57.15) v1(80.61,59.19) v1(80.94,57.15) v1(81.28,59.18) v1(81.41,58.17) v1(81.53,57.02) v1(81.91,70.48) v1(82.3,68.96) v1(83.06,67.69) v1(84,66.83) v1(84.96,65.79) v1(85.22,71.12) v1(86.11,74.17) v1(86.36,75.18) v1(86.61,57.79) v1(87.12,43.34) v1(88.14,74.8) v1(88.26,50.55) v1(89.66,57.91) v1(90.17,47.62) v1(91.31,65.79) v1(91.69,63.5) v1(91.69,61.47) v1(92.96,65.02) v1(93,64.64) v1(92.96,57.91) v1(93.09,70.87) v1(93.09,56.39) v1(93.22,67.06) v1(93.22,55.5) v1(93.34,48.77) v1(93.73,62.1)
VBUS: length 23.6
  Top Layer w0.254: 86.9,67.04 84.85,67.04 83.95,67.95 83.95,72.53 R2.2 ; F1.1 79.63,53.97 79.88,53.72 79.88,48.77 81.21,47.44 Q2.1 81.21,46.05 R13.1
  Top Layer w0.66: 89.03,67.04 USB1.B4A9 86.9,67.04 ; 85.72,62.23 88.9,62.23
232_RX1: length 22.3
  Top Layer w0.203: v1(27.18,13.72) 27.25,13.65 28.96,13.65 U7.9 ; U15.15 30.04,29.91 v1(29.84,29.72)
  Bottom Layer w0.203: v1(27.18,13.72) 26.8,14.1 26.8,28.7 27.81,29.72 v1(29.84,29.72)
232_RX2: length 17.6
  Top Layer w0.203: v1(25.27,17.53) U7.12 ; v1(24.76,29.46) 25.21,29.91 U15.2
  Bottom Layer w0.203: v1(25.27,17.53) 24.76,18.03 v1(24.76,29.46)
485_A: length 9.6
  Top Layer w0.203: CN2.3 9.48,8.97 D6.2 9.9,12.61 R27.2 10.03,14.49 U10.6
485_B: length 9.3
  Top Layer w0.203: U10.7 11.31,16.78 R21.1 11.31,12.73 D5.2 11.85,8.21 CN2.2
485_RX2: length 22.5
  Top Layer w0.203: U15.4 11.11,28.64 8.76,26.29 U10.4
BOOT0: length 3.8
  Top Layer w0.305: U5.46 35.95,55.62 R23.1
ESP_RXD: length 24.5
  Top Layer w0.254: 33.53,73.15 34.8,71.88 37.34,71.88 38.1,71.12 38.1,55.63 36.95,54.48 U5.44
ESP_TXD: length 13.2
  Top Layer w0.254: 36.07,65.53 36.45,65.15 U5.45
IOC_VREF: length 11.1
  Top Layer w0.254: U11.1 36.81,42.15 38.45,43.79 U5.20 ; U11.1 U11.2 34.44,42.1 C26.2 ; U11.1 36.38,41.1 36.96,40.52 R16.1
KEY1: length 85.2
  Top Layer w0.203: v1(81.15,8.51) 81.15,4.7 88.08,4.7 SW3.2 ; U5.17 36.95,44.58 v1(36.45,44.07)
  Bottom Layer w0.203: v1(36.45,44.07) 36.45,42.93 40.64,38.73 72.39,38.73 81.15,29.97 v1(81.15,8.51)
KEY2: length 89.6
  Top Layer w0.203: SW4.2 71.13,1.65 78.49,1.65 80.26,3.43 v1(80.26,8) ; U5.16 36.45,44.96 35.69,44.2 v1(35.69,44.07)
  Bottom Layer w0.203: v1(35.69,44.07) 35.69,43.89 36.14,43.43 36.14,41.83 40.13,37.85 72.01,37.85 80.26,29.59 v1(80.26,8)
KEY3: length 99.4
  Top Layer w0.203: v1(79.5,8.51) 79.5,3.68 78.61,2.79 68.07,2.79 67.7,2.42 67.7,1.78 60.9,1.78 ; U5.15 35.95,45.23 35.05,44.32 35.05,43.69 v1(35.56,43.18)
  Bottom Layer w0.203: v1(35.56,43.18) 35.56,41.02 39.62,36.96 71.88,36.96 79.5,29.34 v1(79.5,8.51)
KEY4: length 109.1
  Top Layer w0.203: U5.14 35.45,45.25 34.42,44.22 v1(34.42,43.56) ; 50.7,1.65 57.5,1.65 57.5,2.51 58.29,3.3 78.23,3.3 78.87,3.94 v1(78.87,8)
  Bottom Layer w0.203: v1(34.42,43.56) 34.42,40.89 39.37,35.94 71.75,35.94 78.87,28.83 v1(78.87,8)
LCD_BL: length 16.1
  Top Layer w0.203: U5.18 37.46,44.47 37.17,44.18 37.17,43.52 v1(37.08,43.43) ; FPC1.3 47.91,40.67 v1(47.5,40.26)
  Bottom Layer w0.203: v1(47.5,40.26) 40.26,40.26 v1(37.08,43.43)
LCD_CLK: length 9.9
  Top Layer w0.254: v1(43.18,46.61) 42.97,46.82 U5.26 ; v1(48.01,42.93) 48.25,43.17 FPC1.8
  Bottom Layer w0.254: v1(48.01,42.93) 46.86,42.93 v1(43.18,46.61)
LCD_CS: length 12.7
  Top Layer w0.254: v1(44.2,46.99) 43.87,47.32 U5.27 ; FPC1.7 v1(50.67,42.67)
  Bottom Layer w0.254: v1(50.67,42.67) 49.41,42.67 45.09,46.99 v1(44.2,46.99)
LCD_DC: length 14.6
  Top Layer w0.203: FPC1.4 47.14,41.17 v1(46.86,40.89)
  Top Layer w0.254: v1(37.85,44.07) 37.95,44.18 U5.19
  Bottom Layer w0.203: v1(37.85,44.07) 41.02,40.89 v1(46.86,40.89)
LCD_DI: length 11.7
  Top Layer w0.254: U5.28 44.19,47.82 44.78,47.23 44.78,45.33 47.94,42.17 FPC1.6
LCD_RST: length 10.2
  Top Layer w0.254: U5.25 42.45,46.32 47.1,41.67 FPC1.5
MCU_A: length 18.7
  Top Layer w0.254: v1(32.38,45.72) 32.98,46.32 U5.12 ; R19.1 v1(39.24,33.27)
  Bottom Layer w0.254: v1(39.24,33.27) 32.38,40.13 v1(32.38,45.72)
MCU_B: length 17.4
  Top Layer w0.254: v1(33.78,45.21) 34.19,45.62 U5.13 ; R14.1 v1(40.64,33.15)
  Bottom Layer w0.254: v1(40.64,33.15) 33.78,40.01 v1(33.78,45.21)
MCU_RX1: length 32.4
  Top Layer w0.203: v1(32.26,46.61) 32.47,46.82 U5.11
  Top Layer w0.254: v1(50.16,31.75) 51.22,31.75 R8.1
  Bottom Layer w0.203: v1(32.26,46.61) 31.8,46.15 31.8,38.94 38.99,31.75 v1(50.16,31.75)
MCU_RX2: length 47.4
  Top Layer w0.203: v1(41.28,44.7) 41.02,44.45 40.64,44.45 40.45,44.64 U5.24
  Top Layer w0.254: 52.77,31.74 52.83,31.68 v1(52.83,31.24)
  Bottom Layer w0.203: v1(52.83,31.24) 52.45,30.86 38.86,30.86 31.37,38.35 31.37,46.51 32.03,47.17 34.11,47.17 34.8,46.48 40.89,46.48 41.28,46.1 v1(41.28,44.7)
NRST: length 22.1
  Top Layer w0.254: U5.7 33.45,48.82 29.59,44.96 24.64,44.96 23.75,45.85 23.75,50.32 SW2.3
  Top Layer w0.305: SW2.3 22.8,51.52 C21.2 23,53.16 R10.1
OSC_IN: length 9.9
  Top Layer w0.254: C30.1 27.47,53.19 X1.1 27.47,50.63 28.29,49.82 U5.5
OSC_OUT: length 7.4
  Top Layer w0.254: 34.25,49.32 29.68,49.32 X1.3 29.17,46.89 C27.2
PA8: length 12.2
  Top Layer w0.254: FPC1.9 46.94,43.67 45.67,44.94 45.67,48.12 44.97,48.82 U5.30
PA9: length 12.2
  Top Layer w0.254: FPC1.10 46.94,44.17 46.03,45.09 46.03,48.27 44.97,49.32 41.15,49.32
PA10: length 12.2
  Top Layer w0.254: U5.32 44.98,49.82 46.38,48.42 46.38,45.23 46.95,44.67 FPC1.11
PA11: length 49.6
  Top Layer w0.254: R25.2 81.16,63.37 80.66,63.87 71.87,63.87 68.07,60.07 68.07,54.57 63.82,50.32 U5.33
PA12: length 49.6
  Top Layer w0.254: R24.2 81.16,64.77 80.66,64.27 71.64,64.27 67.67,60.3 67.67,54.74 63.75,50.82 U5.34
PA13: length 43.4
  Top Layer w0.254: U5.36 41.15,53.22 42.8,54.86 58.35,54.86 67.06,63.57 67.06,71.12 69.09,73.15 H1.2
PA14: length 42.4
  Top Layer w0.254: H1.3 66.55,63.56 58.48,55.5 42.16,55.5 40.45,53.79 U5.37
PB3: length 20.5
  Top Layer w0.254: U14.5 51.68,56.89 50.93,56.13 41.4,56.13 38.45,53.19 U5.41
PB4: length 21.7
  Top Layer w0.254: U14.7 53.85,61.9 v1(53.85,59.82) ; v1(39.88,55.5) 37.95,53.57 U5.42
  Bottom Layer w0.254: v1(39.88,55.5) 40.26,55.88 49.91,55.88 v1(53.85,59.82)
PB5: length 18.8
  Top Layer w0.254: U14.3 49.48,58.5 47.88,56.9 40.39,56.9 37.46,53.97 U5.43
PC6: length 9.5
  Top Layer w0.254: v1(45.09,47.88) 44.64,48.32 U5.29 ; v1(48.01,45.34) 48.18,45.17 FPC1.12
  Bottom Layer w0.254: v1(48.01,45.34) 47.62,45.34 v1(45.09,47.88)
PC11: length 18.3
  Top Layer w0.254: v1(48.39,60.07) 48.38,60.08 U14.2 ; U5.40 38.95,53.1 39.45,53.59 v1(39.75,53.59)
  Bottom Layer w0.254: v1(39.75,53.59) 39.29,54.05 39.29,55.74 39.94,56.39 47.5,56.39 48.39,57.28 v1(48.39,60.07)
RS232_RXD: length 12.6
  Top Layer w0.203: U7.8 22.73,13.72 22.22,13.21 22.22,11.81 22.48,11.56 D4.1 25.45,11.56 25.65,11.35 25.65,10.54 25.53,10.41 24.51,10.41 24.38,10.29 24.38,9.65 24.51,9.53 25.65,9.53 26.29,8.89 CN1.2
RS232_TXD: length 12.6
  Top Layer w0.203: CN1.1 30.65,8.43 D3.1 30.65,18.5 30.35,18.8 U7.13
RX1: length 16.8
  Top Layer w0.203: R9.2 37.69,24.67 33.72,28.64 U15.13
RX2: length 27.9
  Top Layer w0.203: U15.3 27.37,29.27 27.67,29.58 27.67,30.97 27.99,31.29 34.62,31.29 34.82,31.09 34.82,28.29 37.72,25.4 47.47,25.4 R12.2
SW_A: length 8.3
  Top Layer w0.203: R20.2 36.45,23.88 33.59,26.73 U15.10
SW_B: length 7
  Top Layer w0.203: R15.2 35.05,24.38 33.34,26.1 U15.9
TTL_RX1: length 26.3
  Top Layer w0.203: v1(33.78,29.21) 33.72,29.27 U15.14
  Bottom Layer w0.203: v1(33.78,29.21) 40.39,22.61 CN3.2
TTL_RX2: length 27.2
  Top Layer w0.203: v1(28.19,28) U15.5
  Bottom Layer w0.203: CN3.3 36.58,22.61 31.18,28 v1(28.19,28)
USB_D+: length 7.5
  Top Layer w0.254: R29.2 R24.1 85.86,64.77 ; USB1.A6 86.23,64.39 85.86,64.77 ; 85.86,64.77 85.79,64.84 86.35,65.39 USB1.B6
USB_D-: length 7.5
  Top Layer w0.254: USB1.A7 88.27,64.89 88.52,64.64 88.52,64.13 88.28,63.89 USB1.B7 86.25,63.89 85.72,63.37 R25.1
USB_GND: length 30.5
  Top Layer w0.254: v1(78.74,48.13) 78.1,48.13 77.78,47.81 Q1.1 78.11,47 R7.2 ; USB1.B1A12 v1(85.98,67.84)
  Bottom Layer w0.254: v1(78.74,48.13) 84.33,48.13 85.72,49.53 85.72,67.59 v1(85.98,67.84) 85.98,67.82
$1N5356: length 13.4
  Top Layer w0.254: R17.1 v1(90.17,72.26) ; USB1.A5 88.75,63.39 v1(88.77,63.37)
  Bottom Layer w0.254: v1(88.77,63.37) 89.41,63.37 90.17,64.14 v1(90.17,72.26)
$1N5357: length 7.8
  Top Layer w0.254: v1(89.53,70.74) R18.1 ; USB1.B5 88.04,66.39 v1(88.39,66.04)
  Bottom Layer w0.254: v1(88.39,66.04) 89.53,67.18 v1(89.53,70.74)
$1N5435: length 2.7
  Top Layer w0.203: 51.6,27.73 51.6,29.98 R8.2
$1N5438: length 2.6
  Top Layer w0.203: 52.87,27.73 52.87,30.2 R11.2
$1N5439: length 8.4
  Top Layer w0.254: U8.2 51.6,23.2 51.18,23.62 49.91,23.62 49.28,22.99 49.28,22.1 48.9,21.72 47.37,21.72 46.86,22.23 46.86,23.06 R9.1
$1N5442: length 6.8
  Top Layer w0.254: U8.3 52.87,23.71 52.45,24.13 49.2,24.13 R12.1
$1N5453: length 3.7
  Top Layer w0.508: C17.2 20.99,20.07 U7.3
$1N5454: length 3.5
  Top Layer w0.508: U7.4 20.48,18.8 C16.2
$1N5455: length 3.4
  Top Layer w0.508: C16.1 20.35,17.53 U7.5
$1N5456: length 3.5
  Top Layer w0.508: U7.6 20.64,16.26 C18.2
$1N5517: length 3.5
  Top Layer w0.508: U7.1 23.21,22.27 C17.1
$1N5518: length 5.2
  Top Layer w0.508: U7.2 24.76,21.34 25.27,21.84 25.27,23.24 24.38,24.13 C13.1
$1N7538: length 2.4
  Top Layer w0.254: U2.2 76.45,58.8 75.7,58.05
$1N7723: length 17.1
  Top Layer w0.254: v1(84.71,58.8) U2.7 ; v1(79.63,70.87) 79.63,72.63 LED1.1
  Bottom Layer w0.254: v1(84.71,58.8) 84.71,64.14 79.63,69.22 v1(79.63,70.87)
$1N7727: length 21.9
  Top Layer w0.254: LED2.1 78.11,74.94 v1(77.98,74.8) ; U2.6 v1(82.42,57.53)
  Bottom Layer w0.254: v1(77.98,74.8) 77.98,70.1 82.42,65.66 v1(82.42,57.53)
$1N7798: length 5.3
  Top Layer w0.254: 81.84,74.92 LED2.2 ; 81.84,74.92 LED1.2 ; 81.84,74.92 82.1,75.18 83.69,75.18 83.82,75.06 R2.1
$1N9034: length 1.6
  Top Layer w0.254: R4.2 83.22,38.9 83.22,37.4
$1N9277: length 3.2
  Top Layer w0.254: U4.3 80.39,35.28 R6.2 R3.1
$1N27774: length 2.8
  Top Layer w0.254: R14.2 40.51,30.36 U9.2
$1N27777: length 2.8
  Top Layer w0.254: U9.3 R19.2
$1N27778: length 9.1
  Top Layer w0.254: U9.7 40.51,19.94 39.62,19.05 35.31,19.05 35.05,19.3 R15.1
$1N27781: length 4.7
  Top Layer w0.254: R20.1 38.62,20.07 39.24,20.7 U9.6

## Copper pours and planes (outline as drawn; the poured copper is in the pictures)
3.3V on Top Layer: 63.75,41.53 70.61,41.53 70.61,40.13 63.75,40.13
5V on Top Layer: 71.5,42.93 73.28,42.93 73.41,42.8 73.41,42.04 75.06,42.04 75.31,42.29 77.62,42.29 77.62,37 73.76,37 73.76,35.05 69.49,35.05 69.49,38.7 69.53,38.73 71.12,38.73 71.12,40.26 71.25,40.39 71.25,41.02 71.37,41.15 73.03,41.15 73.03,42.06 72.86,42.23 71.5,42.23
DGND on Top Layer: outline of 95 points within 3.3,2.54 72.83,33.02
DVDD on Top Layer: 54.86,20.19 54.92,20.13 54.92,19.47 58.21,19.47 58.29,19.56 58.29,23.26 57.06,23.26 57.06,21.05 57.03,20.96 54.86,20.96
PGND on Top Layer: 37.08,34.42 94.67,34.42 94.67,24.27 37.08,24.27
PGND on Top Layer: 0,76.33 94.67,76.33 94.67,33.12 0,33.12
PGND on Top Layer: 74.17,25.91 94.67,25.91 94.67,0 74.17,0
PGND on Top Layer: 48.64,7.24 94.67,7.24 94.67,0 48.64,0
PGND on Bottom Layer: 0,76.33 94.67,76.33 94.67,33.12 0,33.12
VBUS on Top Layer: 86.52,67.34 86.57,67.3 86.57,66.74 86.61,66.69 88.68,66.69 89.17,66.2 89.17,62.65 89.11,62.6 72.75,62.6 70.95,60.8 70.95,53.19 71.71,52.44 76.74,52.44 77.56,53.25 79.33,53.25 79.5,53.42 79.5,55.09 79.31,55.28 73.54,55.28 72.98,55.84 72.98,59.9 72.9,59.98 73.59,60.67 85.48,60.67 86.72,61.92 89.53,61.92 90.19,62.57 90.19,67.12 89.96,67.35 86.53,67.35
VBUS on Top Layer: 82.42,61.34 84.71,61.34 84.71,59.69 82.42,59.69
VIN on Top Layer: 93.81,39.96 93.47,39.62 89.03,39.62 88.65,40.01 88.65,43.69 87.63,44.7 85.98,44.7 85.72,44.45 85.72,43.82 79.38,43.82 79.12,44.07 79.12,47.62 79.38,47.88 80.14,47.88 80.52,47.5 80.52,45.09 84.2,45.09 84.2,46.61 83.95,46.86 82.68,46.86 82.64,46.9 82.64,48.16 82.75,48.26 85.09,48.26 85.51,47.84 85.51,46.56 85.59,46.48 88.65,46.48 90.55,44.58 90.55,42.55 91.48,41.61 93.81,41.61
BAT+ on Top Layer: 82.69,56.64 84.3,56.64 84.3,53.26 82.69,53.26
BAT+ on Top Layer: 80.06,53.1 80.26,52.9 92.65,52.9 92.84,53.09 92.84,54.1 92.2,54.74 80.06,54.74
D_5V on Top Layer: 61.52,17.5 67.94,17.5 67.94,15.88 61.52,15.88
D_5V on Top Layer: 57.28,19.05 57.28,16.28 57.68,15.88 61.95,15.88 61.95,17.07 61.23,17.79 60.03,17.79 60.03,19.09 59.94,19.18 59.29,19.18 59.29,17.76 59.18,17.65 58.04,17.65 58.04,19.08 57.3,19.08
$1N5372 on Top Layer: 65.91,34.42 65.91,28.32 68.57,28.32 68.83,28.59 68.83,32 69.47,32.64 71.75,32.64 72.39,33.27 72.39,34.42 72.37,34.54 66.04,34.54
$1N8863 on Top Layer: 73.45,56.91 78.59,56.91 78.59,55.88 73.45,55.88
$1N9169 on Top Layer: 78.87,42.79 82.3,42.79 82.3,40.26 81.19,40.26 81.16,40.23 81.16,37.07 78.88,37.07 78.87,37.08
$1N19970 on Top Layer: 80.14,52.2 80.14,49.66 80.93,48.87 82.65,48.87 82.65,52.05 82.3,52.4 80.34,52.4
$1N20026 on Top Layer: 77.47,49.17 77.75,48.9 79.25,48.9 79.5,49.15 79.5,52.4 77.47,52.4
$1N28343 on Top Layer: 93.34,39.5 93.34,38.06 93.09,37.59 88.52,37.59 85.93,35 82.72,35 82.37,35.34 82.37,36.67 82.39,36.67 82.55,36.83 85.6,36.83 85.6,38.35 83.82,40.13 83.19,40.13 82.8,40.51 82.75,40.51 82.75,42.55 82.95,42.8 85.6,42.8 85.6,40.51 86.61,39.5

Small or netless copper shapes (teardrops, artwork), in the pictures only: 348 on Top Layer, 55 on Bottom Layer
